# Altium schematic sheet UAARG Autopilot.SchDoc
size 355 x 228 mm; DocumentNumber: 2; SheetNumber: 2; SheetTotal: 16
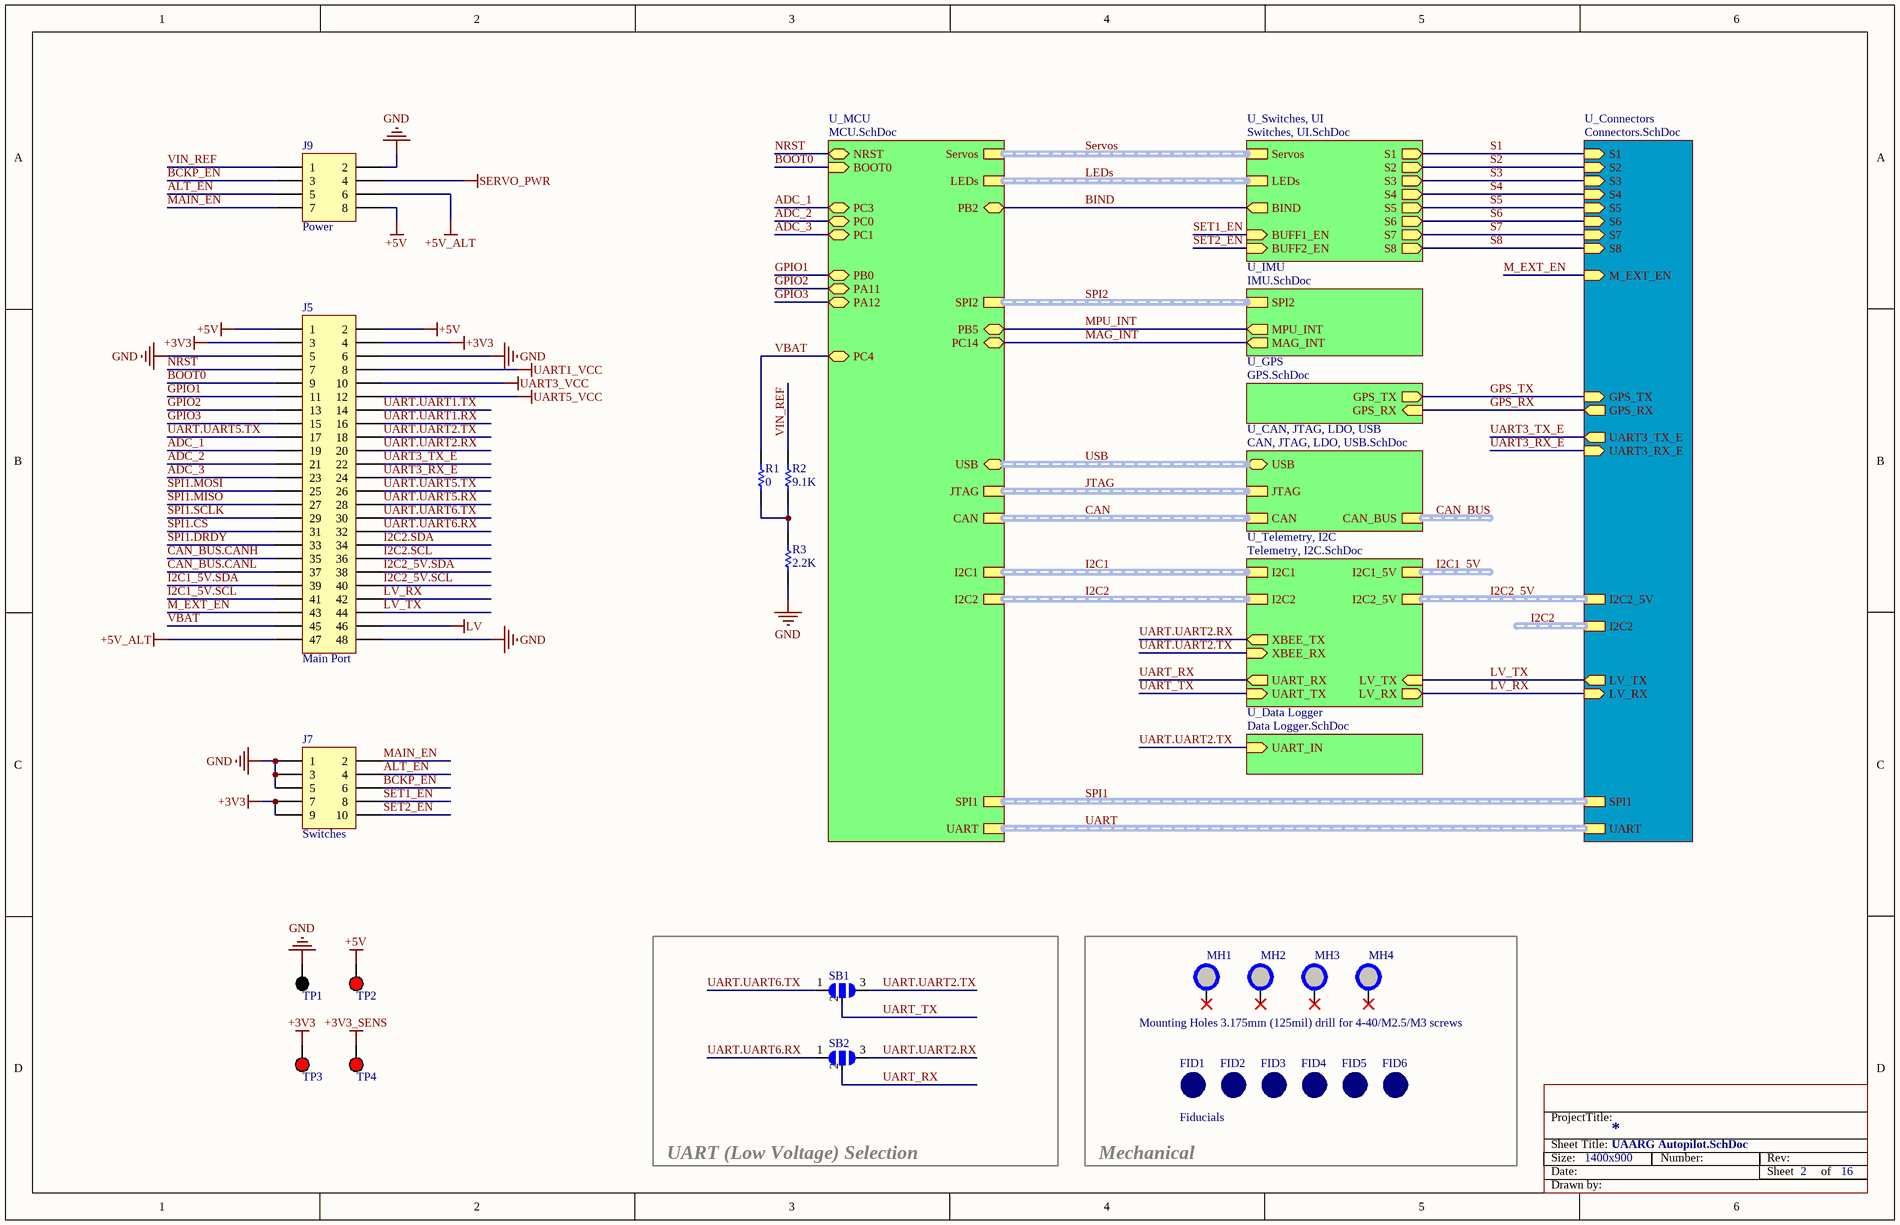
[diagram p0: UAARG Autopilot.SchDoc]

## Parts
FID1  Ficudial  [FIDUCIAL_1]  (value not drawn)  (no BOM)
FID2  Ficudial  [FIDUCIAL_1]  (value not drawn)  (no BOM)
FID3  Ficudial  [FIDUCIAL_1]  (value not drawn)  (no BOM)
FID4  Ficudial  [FIDUCIAL_1]  (value not drawn)  (no BOM)
FID5  Ficudial  [FIDUCIAL_1]  (value not drawn)  (no BOM)
FID6  Ficudial  [FIDUCIAL_1]  (value not drawn)  (no BOM)
J5  Main Port  [HDR_2X24]  (no BOM)
J7  Switches  [HDR_2X05]  (no BOM)
J9  Power  [2X04]  (no BOM)
MH1  Mounting Hole  [MOUNTINGHOLE_6]  (value not drawn)  (no BOM)
MH2  Mounting Hole  [MOUNTINGHOLE_6]  (value not drawn)  (no BOM)
MH3  Mounting Hole  [MOUNTINGHOLE_6]  (value not drawn)  (no BOM)
MH4  Mounting Hole  [MOUNTINGHOLE_6]  (value not drawn)  (no BOM)
R1  value 0  [RES_0402[1005M]]  (hidden comment: RES)
R2  value 9.1K  [RES_0603[1608M]]  (hidden comment: RES)
R3  value 2.2K  [RES_0603[1608M]]  (hidden comment: RES)
SB1  SMD Jumper 1  [SMD JUMPER 1]  (value not drawn)  (no BOM)
SB2  SMD Jumper 1  [SMD JUMPER 1]  (value not drawn)  (no BOM)
TP1  Test Point GND  [TP_TH_1_SILK]  (value not drawn)  (no BOM)
TP2  Test Point VCC  [TP_TH_1_SILK]  (value not drawn)  (no BOM)
TP3  Test Point VCC  [TP_TH_1_SILK]  (value not drawn)  (no BOM)
TP4  Test Point VCC  [TP_TH_1_SILK]  (value not drawn)  (no BOM)

## Blocks framed on the sheet
UART (Low Voltage) Selection: SB1 SB2
Mechanical: FID1-FID6 MH1-MH4

## Sub-sheets
U_CAN, JTAG, LDO, USB = CAN, JTAG, LDO, USB.SchDoc: JTAG (harness JTAG), CAN (harness CAN), CAN_BUS (harness CAN_BUS), USB (harness USB)
U_Connectors = Connectors.SchDoc: S1 (in), S2 (in), S3 (in), S4 (in), S5 (in), S6 (in), S7 (in), S8 (in), M_EXT_EN (in), I2C2 (harness I2C2), I2C2_5V (harness I2C2_5V), UART (harness UART), GPS_TX (in), GPS_RX (out), SPI1 (harness SPI1), LV_TX (out), LV_RX (in), UART3_RX_E (in), UART3_TX_E (out)
U_Data Logger = Data Logger.SchDoc: UART_IN (in)
U_GPS = GPS.SchDoc: GPS_RX (in), GPS_TX (out)
U_IMU = IMU.SchDoc: MPU_INT (out), MAG_INT (out), SPI2 (harness SPI2)
U_MCU = MCU.SchDoc: PB0 (bidir), PB2 (bidir), PB5 (bidir), PA11 (bidir), PA12 (bidir), PC0 (bidir), PC1 (bidir), PC3 (bidir), PC4 (bidir), PC14 (bidir), NRST (bidir), BOOT0 (in), Servos (harness Servos), JTAG (harness JTAG), CAN (harness CAN), I2C1 (harness I2C1), I2C2 (harness I2C2), LEDs (harness LEDs), SPI1 (harness SPI1), SPI2 (harness SPI2), UART (harness UART), USB (harness USB)
U_Switches, UI = Switches, UI.SchDoc: S1 (out), S2 (out), S3 (out), S4 (out), S5 (out), S6 (out), S7 (out), S8 (out), LEDs (harness LEDs), Servos (harness Servos), BIND (out), BUFF1_EN (in), BUFF2_EN (in)
U_Telemetry, I2C = Telemetry, I2C.SchDoc: XBEE_RX (in), XBEE_TX (out), LV_RX (out), LV_TX (in), I2C1 (harness I2C1), I2C2 (harness I2C2), I2C1_5V (harness I2C1_5V), I2C2_5V (harness I2C2_5V), UART_TX (in), UART_RX (out)

## Nets
+3V3: J5.3 J5.4 J7.7 J7.9 TP3.1
+3V3_SENS: TP4.1
+5V: J5.1 J5.2 J9.8 TP2.1
+5V_ALT: J5.47 J9.6
GND: J5.5 J5.6 J5.48 J7.1 J7.3 J7.5 J9.2 R3.1 TP1.1
LV: J5.46
SERVO_PWR: J9.4
UART1_VCC: J5.8
UART3_VCC: J5.10
UART5_VCC: J5.12
ADC_1: J5.19 ; sheet U_MCU/PC3
ADC_2: J5.21 ; sheet U_MCU/PC0
ADC_3: J5.23 ; sheet U_MCU/PC1
ALT_EN: J7.4 J9.5
BCKP_EN: J7.6 J9.3
BIND: sheet U_Switches, UI/BIND, sheet U_MCU/PB2
BOOT0: J5.9 ; sheet U_MCU/BOOT0
CAN_BUS.CANH: J5.35
CAN_BUS.CANL: J5.37
GPIO1: J5.11 ; sheet U_MCU/PB0
GPIO2: J5.13 ; sheet U_MCU/PA11
GPIO3: J5.15 ; sheet U_MCU/PA12
GPS_RX: sheet U_GPS/GPS_RX, sheet U_Connectors/GPS_RX
GPS_TX: sheet U_GPS/GPS_TX, sheet U_Connectors/GPS_TX
I2C1_5V.SCL: J5.41
I2C1_5V.SDA: J5.39
I2C2.SCL: J5.36
I2C2.SDA: J5.34
I2C2_5V.SCL: J5.40
I2C2_5V.SDA: J5.38
LV_RX: J5.42 ; sheet U_Telemetry, I2C/LV_RX, sheet U_Connectors/LV_RX
LV_TX: J5.44 ; sheet U_Telemetry, I2C/LV_TX, sheet U_Connectors/LV_TX
M_EXT_EN: J5.43 ; sheet U_Connectors/M_EXT_EN
MAG_INT: sheet U_MCU/PC14, sheet U_IMU/MAG_INT
MAIN_EN: J7.2 J9.7
MPU_INT: sheet U_MCU/PB5, sheet U_IMU/MPU_INT
NRST: J5.7 ; sheet U_MCU/NRST
S1: sheet U_Switches, UI/S1, sheet U_Connectors/S1
S2: sheet U_Switches, UI/S2, sheet U_Connectors/S2
S3: sheet U_Switches, UI/S3, sheet U_Connectors/S3
S4: sheet U_Switches, UI/S4, sheet U_Connectors/S4
S5: sheet U_Switches, UI/S5, sheet U_Connectors/S5
S6: sheet U_Switches, UI/S6, sheet U_Connectors/S6
S7: sheet U_Switches, UI/S7, sheet U_Connectors/S7
S8: sheet U_Switches, UI/S8, sheet U_Connectors/S8
SET1_EN: J7.8 ; sheet U_Switches, UI/BUFF1_EN
SET2_EN: J7.10 ; sheet U_Switches, UI/BUFF2_EN
SPI1.CS: J5.31
SPI1.DRDY: J5.33
SPI1.MISO: J5.27
SPI1.MOSI: J5.25
SPI1.SCLK: J5.29
UART3_RX_E: J5.24 ; sheet U_Connectors/UART3_RX_E
UART3_TX_E: J5.22 ; sheet U_Connectors/UART3_TX_E
UART.UART1.RX: J5.16
UART.UART1.TX: J5.14
UART.UART2.RX: J5.20 SB2.3 ; sheet U_Telemetry, I2C/XBEE_TX
UART.UART2.TX: J5.18 SB1.3 ; sheet U_Data Logger/UART_IN, sheet U_Telemetry, I2C/XBEE_RX
UART.UART5.RX: J5.28
UART.UART5.TX: J5.17 J5.26
UART.UART6.RX: J5.32 SB2.1
UART.UART6.TX: J5.30 SB1.1
UART_RX: SB2.2 ; sheet U_Telemetry, I2C/UART_RX
UART_TX: SB1.2 ; sheet U_Telemetry, I2C/UART_TX
VBAT: J5.45 R1.2 ; sheet U_MCU/PC4
VIN_REF: J9.1 R2.2
NetR1_1: R1.1 R2.1 R3.2

Not connected (* = marked no-connect by the designer): MH1 1*; MH2 1*; MH3 1*; MH4 1*

## Buses and harness runs
harness CAN = sheet U_CAN, JTAG, LDO, USB/CAN = sheet U_MCU/CAN
harness CAN_BUS = sheet U_CAN, JTAG, LDO, USB/CAN_BUS
harness I2C1 = sheet U_MCU/I2C1 = sheet U_Telemetry, I2C/I2C1
harness I2C1_5V = sheet U_Telemetry, I2C/I2C1_5V
harness I2C2 = sheet U_Connectors/I2C2
harness I2C2 = sheet U_MCU/I2C2 = sheet U_Telemetry, I2C/I2C2
harness I2C2_5V = sheet U_Connectors/I2C2_5V = sheet U_Telemetry, I2C/I2C2_5V
harness JTAG = sheet U_CAN, JTAG, LDO, USB/JTAG = sheet U_MCU/JTAG
harness LEDs = sheet U_MCU/LEDs = sheet U_Switches, UI/LEDs
harness Servos = sheet U_MCU/Servos = sheet U_Switches, UI/Servos
harness SPI1 = sheet U_Connectors/SPI1 = sheet U_MCU/SPI1
harness SPI2 = sheet U_IMU/SPI2 = sheet U_MCU/SPI2
harness UART = sheet U_Connectors/UART = sheet U_MCU/UART
harness USB = sheet U_CAN, JTAG, LDO, USB/USB = sheet U_MCU/USB

## Notes on the sheet
- Mounting Holes 3.175mm (125mil) drill for 4-40/M2.5/M3 screws
- Fiducials
- Sheet Title:
- ProjectTitle:
- Size:
- Date:
- 1400x900
- Number:
- Rev:
- Sheet         of
- Drawn by:

## Library data of the parts
FID1-FID6 = Ficudial: Fiducial
J5 = Header 24X2: Header, 24-Pin, Dual row
J7 = Header 5X2: Header, 5-Pin, Dual row
J9 = Header 4X2: Header, 4-Pin, Dual row
MH1-MH4 = Mounting Hole: pin to pad: 1>MH
R1 = RES: Resistor; Manufacturer Part Number: RC0402JR-070RL; Manufacturer: Yageo; Supplier 1: Digi-Key; Supplier Part Number 1: 311-0.0JRCT-ND; ComponentLink1URL: http://www.yageo.com/NewPortal/yageodocoutput?fileName=/pdf/R-Chip/PYu-RC_Group_51_RoHS_L_3.pdf; ComponentLink1Description: Datasheet
R2 = RES: Resistor; Manufacturer Part Number: RC0603FR-079K1L; Manufacturer: Yageo; Supplier 1: Digi-Key; Supplier Part Number 1: 311-9.10KHRCT-ND; ComponentLink1URL: http://www.yageo.com/NewPortal/yageodocoutput?fileName=/pdf/R-Chip/PYu-RC_Group_51_RoHS_L_3.pdf; ComponentLink1Description: Datasheet
R3 = RES: Resistor; Manufacturer: Yageo; Manufacturer Part Number: RC0603FR-072K2L; Supplier 1: Digi-Key; Supplier Part Number 1: 311-2.20KHRCT-ND; ComponentLink1URL: http://www.yageo.com/NewPortal/yageodocoutput?fileName=/pdf/R-Chip/PYu-RC_Group_51_RoHS_L_3.pdf; ComponentLink1Description: Datasheet
SB1 SB2 = SMD Jumper 1: SMD Jumper 3 positions. Open
TP1 = Test Point GND: Test Point Ground
TP2-TP4 = Test Point VCC: Test Point Power